# EAGLE schematic LEDproject.11.7.18 (EAGLE 9.2.0)
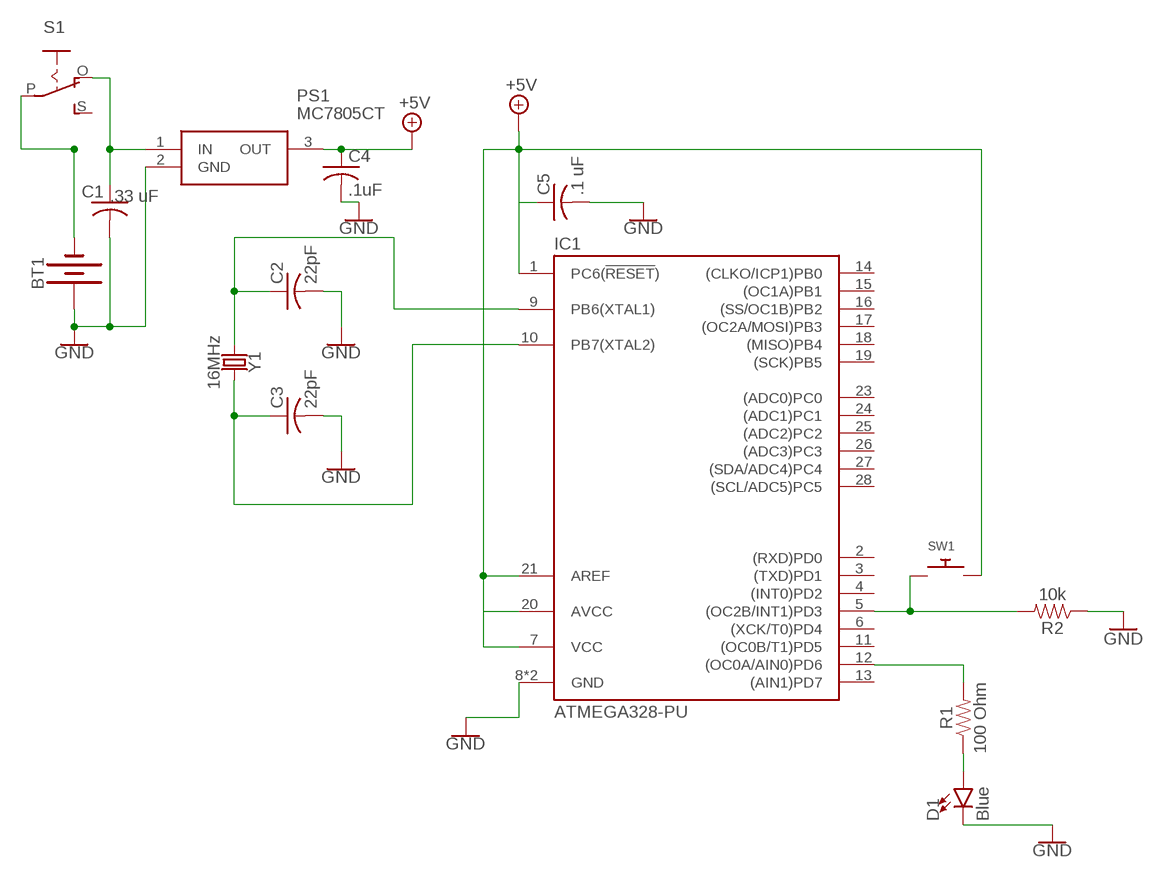
[diagram p0: schematic, sheet 1]

## Parts
BT1  BATTERY-9V  [BATTCON_9V]
C1  C-US025-030X050  [C025-030X050]
C2  22pF  C-US025-030X050  [C025-030X050]
C3  22pF  C-US025-030X050  [C025-030X050]
C4  .1uF  C-US025-030X050  [C025-030X050]
C5  .1 uF  C-US025-030X050  [C025-030X050]
D1  Blue  LED5MM  [LED_5MM]
IC1  ATMEGA328-PU  [DIL28]
PS1  MC7805CT  [TO254P482X997X1968-3P]
R1  100 Ohm  150OHM-0603-1/10W-1%  [0603]
R2  10k  10KOHM-HORIZ-1/4W-1%  [AXIAL-0.3]
S1  EG1218S  [EG1218]
SW1  SWITCH_PUSHBUTTONEVQ-PE  [TACT_PANA-EVQ]
Y1  16MHz  CRYSTAL-16MHZPTH-HC49US  [HC49US]

## Nets
+5V: C4.1 C5.1 IC1.1(PC6(!RESET!)) IC1.7(VCC) IC1.20(AVCC) IC1.21(AREF) PS1.3(OUT) SW1.P$2
GND: BT1.+ C1.2 C2.2 C3.2 C4.2 C5.2 D1.K(C) IC1.8(GND) IC1.22(GND) PS1.2(GND) R2.P$1
N$1: C2.1 IC1.9(PB6(XTAL1)) Y1.1
N$2: C3.1 IC1.10(PB7(XTAL2)) Y1.2
N$3: BT1.- S1.P
N$5: C1.1 PS1.1(IN) S1.O
N$6: IC1.5((OC2B/INT1)PD3) R2.P$2 SW1.P$1
N$7: IC1.12((OC0A/AIN0)PD6) R1.2
N$8: D1.A R1.1
Unconnected: IC1.2((RXD)PD0) IC1.3((TXD)PD1) IC1.4((INT0)PD2) IC1.6((XCK/T0)PD4) IC1.11((OC0B/T1)PD5) IC1.13((AIN1)PD7) IC1.14((CLKO/ICP1)PB0) IC1.15((OC1A)PB1) IC1.16((SS/OC1B)PB2) IC1.17((OC2A/MOSI)PB3) IC1.18((MISO)PB4) IC1.19((SCK)PB5) IC1.23((ADC0)PC0) IC1.24((ADC1)PC1) IC1.25((ADC2)PC2) IC1.26((ADC3)PC3) IC1.27((SDA/ADC4)PC4) IC1.28((SCL/ADC5)PC5) S1.S

## Library data of the parts
BT1 = SparkFun-Batteries:BATTERY: Battery - Single Cell A variety of battery chemistries, sizes, and footprints. Device List: 20MM_PTH - Coin Cell Battery Holder - 20mm (PTH) <https://www.sparkfun.com/products/783> 6.8MM_PTH - Coin Cell Battery Holder - 6.8MM(SMD) <https://www.digikey.com/product-detail/en/seiko-instruments/MS621FE-FL11E/728-1057-ND/1889208?WT.srch=1&gclid=CNOQ5a6LzdQCFZS2wAodXCkE0g> 12MM_SMD - Coin Cell Battery Holder - 12mm (SMD) <https://www.sparkfun.com/products/10592> 12MM_PTH - Coin Cell Battery Holder - 12mm (PTH) <https://www.sparkfun.com/products/7948> 20MM_SMD - 20mm Coin Cell Battery Holder (SMD) (2 legs) Used on the Big Time Watch Kit <https://www.sparkfun.com/products/11734> 20MM_SMD_4LEGS - Coin Cell Battery Holder - 20mm (SMD) <https://www.sparkfun.com/products/11892> 20MM_SMD_4LEGS_OVERPASTE - Coin Cell Battery Holder - 20mm (SMD) <https://www.sparkfun.com/products/11892> (Over-paste on the legs) 24.5MM_PTH - Coin Cell Battery Holder - 24.5mm (PTH) <https://www.sparkfun.com/products/8863> 9V - 9V Battery Holder - PC Mount Used on the SparkFun SparkPunk Sound Kit <https://www.sparkfun.com/products/11177> and SparkFun SparkPunk Sequencer Kit <https://www.sparkfun.com/products/12707> 18650 - Battery Holder - 18650 (PTH) <https://www.sparkfun.com/products/13113> AA - Battery Holder - 1xAA (PTH) <https://www.sparkfun.com/products/7949> AAA - Battery Holder - 1xAAA (PTH) <https://www.sparkfun.com/products/12718> AA_KIT - Battery Holder - 1xAA (PTH) <https://www.sparkfun.com/products/7949> Special kit package - pads only have exposed copper on one side of the board. AAA_KIT - Battery Holder - 1xAAA (PTH) <https://www.sparkfun.com/products/12718> Special kit package - pads only have exposed copper on one side of the board.; PROD_ID: BATT-10855
C1 = adafruit:C-US: CAPACITOR, American symbol; BYPASS1: .33 uF
C2-C5 = adafruit:C-US: CAPACITOR, American symbol
D1 = SparkFun-LED:LED: LED (Generic) Standard schematic elements and footprints for 5mm, 3mm, 1206, and 0603 sized LEDs. Generic LEDs with no color specified.
IC1 = ATMEGA328-PU:ATMEGA328-PU: Atmel ATmega48/88/168/328 AVR Microcontroller; DESCRIPTION: ATmega Series 20 MHz 32 KB Flash 2 KB SRAM 8-Bit Microcontroller - DIP-28; DIGI-KEY_PART_NUMBER: ATMEGA328-PU-ND; DIGI-KEY_PURCHASE_URL: https://www.digikey.com/product-detail/en/microchip-technology/ATMEGA328-PU/ATMEGA328-PU-ND/2271026?utm_source=snapeda&utm_medium=aggregator&utm_campaign=symbol; MF: Microchip; MP: ATMEGA328-PU; PACKAGE: PDIP-28 Microchip
PS1 = SamacSys_Parts:MC7805CT: ON linear voltage regulator,MC7805CT 5V Source: Datasheet <https://componentsearchengine.com/Datasheets/1/MC7805CT.pdf>; DESCRIPTION: ON linear voltage regulator,MC7805CT 5V; HEIGHT: 4.82mm; MANUFACTURER_NAME: ON Semiconductor; MANUFACTURER_PART_NUMBER: MC7805CT; MOUSER_PART_NUMBER: 863-MC7805CT
R1 = SparkFun-Resistors:150OHM: 150Ω resistor A resistor is a passive two-terminal electrical component that implements electrical resistance as a circuit element. Resistors act to reduce current flow, and, at the same time, act to lower voltage levels within circuits. - Wikipedia; PROD_ID: RES-11028; VALUE: 150
R2 = SparkFun-Resistors:10KOHM: 10kΩ resistor A resistor is a passive two-terminal electrical component that implements electrical resistance as a circuit element. Resistors act to reduce current flow, and, at the same time, act to lower voltage levels within circuits. - Wikipedia; PROD_ID: RES-12183
S1 = adafruit:EG1218: SLIDING SWITCH 0.1" spacing through hole, vertical SPDT slide switch http://www.ladyada.net/library/pcb/eaglelibrary.html
SW1 = adafruit:SWITCH_PUSHBUTTON: Buttons SOFTTOUCHSMD_SJ - Soft touch temporary push button (Super Junk Akihabara) Compatible with SKPMANE010 [Mouser: 688-SKPMAN] C&K_KSS = Digikey: KSS221GLFS
Y1 = SparkFun-Clocks:CRYSTAL-16MHZ: 16MHz Crystal Digikey Example <http://www.digikey.com/product-search/en?keywords=535-9122-1-ND> Frequency: 16MHz Frequency Stability: ±50ppm Frequency Tolerance: ±20ppm Load Capacitance: 18pF SparkFun Products: Pro Micro -5V/16MHz <https://www.sparkfun.com/products/12640> SparkFun Serial Enabled LCD Kit <https://www.sparkfun.com/products/10097>; PROD_ID: XTAL-08181; SF_ID: COM-00536